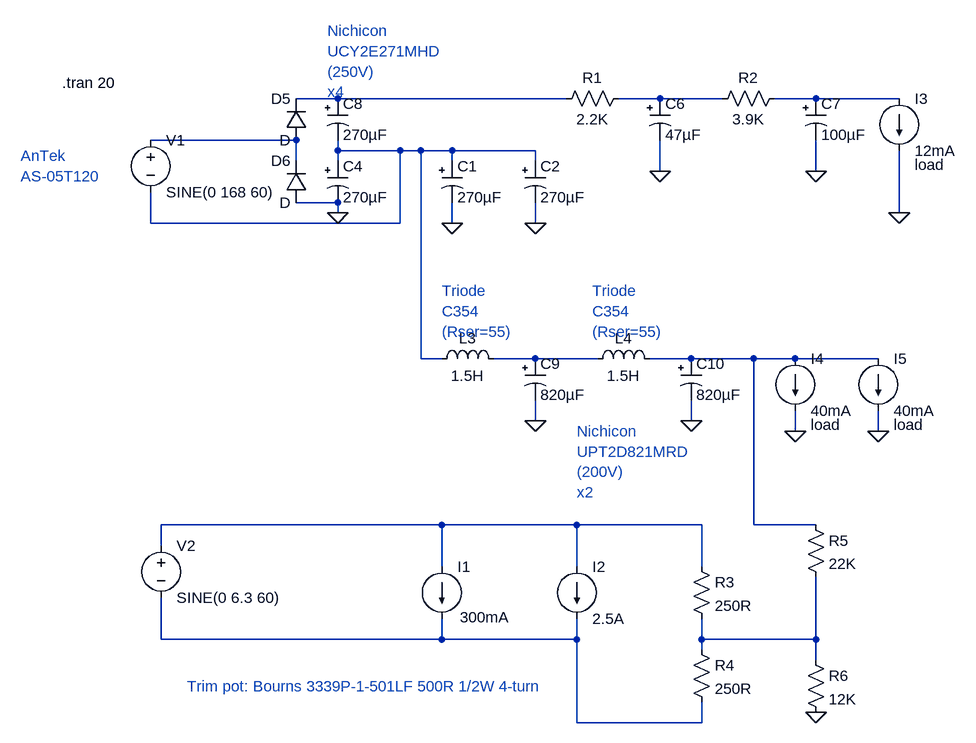
[diagram p0: schematic STPre6080PSU_Simulation.asc]
STPre6080PSU_Simulation.asc, the LTspice schematic file:
Version 4
SHEET 1 1356 1700
WIRE 176 736 112 736
WIRE 528 736 176 736
WIRE 672 736 608 736
WIRE 768 736 672 736
WIRE 912 736 848 736
WIRE 1040 736 912 736
WIRE 112 800 -112 800
WIRE 176 816 176 800
WIRE 272 816 176 816
WIRE 304 816 272 816
WIRE 352 816 304 816
WIRE 480 816 352 816
WIRE 112 832 112 800
WIRE 176 832 176 816
WIRE 352 832 352 816
WIRE 480 832 480 816
WIRE 672 848 672 800
WIRE 912 848 912 800
WIRE 176 896 112 896
WIRE 176 912 176 896
WIRE 1040 912 1040 816
WIRE -112 928 -112 880
WIRE 272 928 272 816
WIRE 272 928 -112 928
WIRE 352 928 352 896
WIRE 480 928 480 896
WIRE 304 1136 304 816
WIRE 336 1136 304 1136
WIRE 480 1136 416 1136
WIRE 576 1136 480 1136
WIRE 720 1136 656 1136
WIRE 816 1136 720 1136
WIRE 880 1136 816 1136
WIRE 1008 1136 880 1136
WIRE 480 1232 480 1200
WIRE 720 1232 720 1200
WIRE 880 1248 880 1216
WIRE 1008 1248 1008 1216
WIRE 336 1392 -96 1392
WIRE 544 1392 336 1392
WIRE 736 1392 544 1392
WIRE 816 1392 816 1136
WIRE 912 1392 816 1392
WIRE -96 1424 -96 1392
WIRE 336 1456 336 1392
WIRE 544 1456 544 1392
WIRE 736 1456 736 1392
WIRE -96 1568 -96 1504
WIRE 336 1568 336 1536
WIRE 336 1568 -96 1568
WIRE 544 1568 544 1536
WIRE 544 1568 336 1568
WIRE 736 1568 736 1536
WIRE 912 1568 912 1472
WIRE 912 1568 736 1568
WIRE 736 1584 736 1568
WIRE 912 1600 912 1568
WIRE 544 1696 544 1568
WIRE 736 1696 736 1664
WIRE 736 1696 544 1696
FLAG 1040 912 0
FLAG 672 848 0
FLAG 912 848 0
FLAG 176 912 0
FLAG 480 1232 0
FLAG 720 1232 0
FLAG 880 1248 0
FLAG 1008 1248 0
FLAG 912 1680 0
FLAG 480 928 0
FLAG 352 928 0
SYMBOL polcap 160 832 R0
SYMATTR InstName C4
SYMATTR Value 270µF
SYMBOL res 624 720 R90
WINDOW 0 0 56 VBottom 2
WINDOW 3 32 56 VTop 2
SYMATTR InstName R1
SYMATTR Value 2.2K
SYMBOL polcap 656 736 R0
SYMATTR InstName C6
SYMATTR Value 47µF
SYMBOL current 1040 736 R0
WINDOW 39 24 102 Left 2
SYMATTR SpiceLine load
SYMATTR InstName I3
SYMATTR Value 12mA
SYMBOL res 864 720 R90
WINDOW 0 0 56 VBottom 2
WINDOW 3 32 56 VTop 2
SYMATTR InstName R2
SYMATTR Value 3.9K
SYMBOL polcap 896 736 R0
SYMATTR InstName C7
SYMATTR Value 100µF
SYMBOL diode 128 800 R180
WINDOW 0 24 64 Left 2
WINDOW 3 24 0 Left 2
SYMATTR InstName D5
SYMBOL diode 128 896 R180
WINDOW 0 24 64 Left 2
WINDOW 3 24 0 Left 2
SYMATTR InstName D6
SYMBOL voltage -112 784 R0
SYMATTR InstName V1
SYMATTR Value SINE(0 168 60)
SYMBOL polcap 160 736 R0
SYMATTR InstName C8
SYMATTR Value 270µF
SYMBOL ind 320 1152 R270
WINDOW 0 32 56 VTop 2
WINDOW 3 5 56 VBottom 2
SYMATTR InstName L3
SYMATTR Value 1.5H
SYMATTR SpiceLine Rser=55
SYMBOL polcap 464 1136 R0
SYMATTR InstName C9
SYMATTR Value 820µF
SYMBOL ind 560 1152 R270
WINDOW 0 32 56 VTop 2
WINDOW 3 5 56 VBottom 2
SYMATTR InstName L4
SYMATTR Value 1.5H
SYMATTR SpiceLine Rser=55
SYMBOL polcap 704 1136 R0
SYMATTR InstName C10
SYMATTR Value 820µF
SYMBOL current 880 1136 R0
WINDOW 39 24 102 Left 2
SYMATTR SpiceLine load
SYMATTR InstName I4
SYMATTR Value 40mA
SYMBOL current 1008 1136 R0
WINDOW 39 24 102 Left 2
SYMATTR SpiceLine load
SYMATTR InstName I5
SYMATTR Value 40mA
SYMBOL voltage -96 1408 R0
SYMATTR InstName V2
SYMATTR Value SINE(0 6.3 60)
SYMBOL current 336 1456 R0
WINDOW 3 28 78 Left 2
SYMATTR Value 300mA
SYMATTR InstName I1
SYMBOL current 544 1456 R0
SYMATTR InstName I2
SYMATTR Value 2.5A
SYMBOL res 720 1440 R0
SYMATTR InstName R3
SYMATTR Value 250R
SYMBOL res 720 1568 R0
SYMATTR InstName R4
SYMATTR Value 250R
SYMBOL res 896 1376 R0
SYMATTR InstName R5
SYMATTR Value 22K
SYMBOL res 896 1584 R0
SYMATTR InstName R6
SYMATTR Value 12K
SYMBOL polcap 336 832 R0
SYMATTR InstName C1
SYMATTR Value 270µF
SYMBOL polcap 464 832 R0
SYMATTR InstName C2
SYMATTR Value 270µF
TEXT -248 712 Left 2 !.tran 20
TEXT 336 1032 Left 2 ;Triode\nC354\n(Rser=55)
TEXT 160 632 Left 2 ;Nichicon\nUCY2E271MHD\n(250V)\nx4
TEXT 568 1032 Left 2 ;Triode\nC354\n(Rser=55)
TEXT 544 1248 Left 2 ;Nichicon\nUPT2D821MRD\n(200V)\nx2
TEXT -312 824 Left 2 ;AnTek\nAS-05T120
TEXT -56 1640 Left 2 ;Trim pot: Bourns 3339P-1-501LF 500R 1/2W 4-turn

The netlist it stands for:
* STPre6080PSU_Simulation.asc
C4 N005 0 270µF
R1 N002 N001 2.2K
C6 N002 0 47µF
I3 N003 0 12mA load
R2 N003 N002 3.9K
C7 N003 0 100µF
D5 N004 N001 D
D6 0 N004 D
V1 N004 N005 SINE(0 168 60)
C8 N001 N005 270µF
L3 N005 N006 1.5H Rser=55
C9 N006 0 820µF
L4 N006 N007 1.5H Rser=55
C10 N007 0 820µF
I4 N007 0 40mA load
I5 N007 0 40mA load
V2 N008 N009 SINE(0 6.3 60)
I1 N008 N009 300mA
I2 N008 N009 2.5A
R3 N008 N010 250R
R4 N010 N009 250R
R5 N007 N010 22K
R6 N010 0 12K
C1 N005 0 270µF
C2 N005 0 270µF
.model D D
.lib standard.dio
.tran 20
* Triode
* C354
* (Rser=55)
* Nichicon
* UCY2E271MHD
* (250V)
* x4
* Triode
* C354
* (Rser=55)
* Nichicon
* UPT2D821MRD
* (200V)
* x2
* AnTek
* AS-05T120
* Trim pot: Bourns 3339P-1-501LF 500R 1/2W 4-turn
.backanno
.end